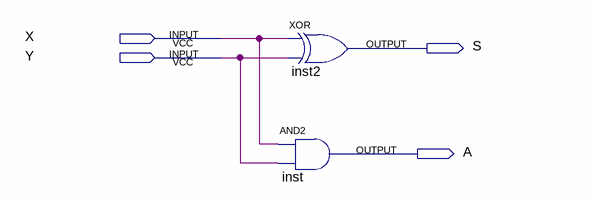
[diagram p0: schematic sheet]
// Quartus schematic meiosomador.bdf as structural Verilog: 2 symbols, 4 pins
module meiosomador (
  input  X,
  input  Y,
  output S,
  output A
);

  xor inst2 (S, X, Y);
  and inst (A, X, Y);
endmodule
